# Altium schematic sheet POWER_5.SchDoc
size A3; SheetNumber: 7; SheetTotal: 13
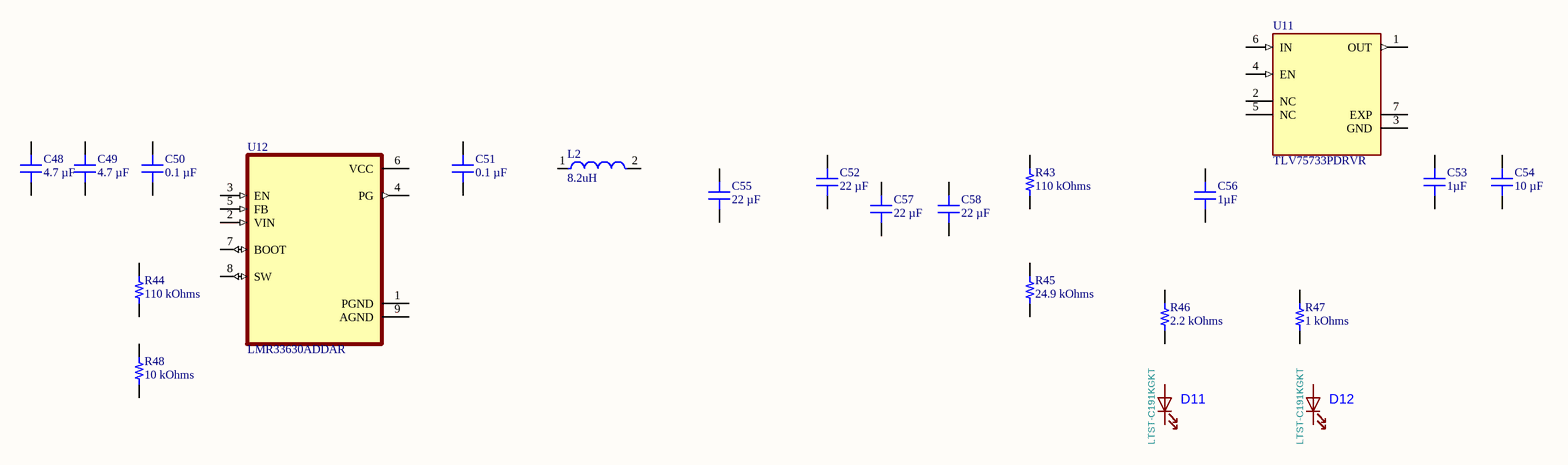
[diagram p0: POWER_5.SchDoc]

## Parts
C48  4.7 µF  [CAP 0603_1608]
C49  4.7 µF  [CAP 0603_1608]
C50  0.1 µF  [CAP 0603_1608]
C51  0.1 µF  [CAP 0603_1608]
C52  22 µF  [CAP 0603_1608]
C53  1µF  [CAP 0805_2012]
C54  10 µF  [CAP 0603_1608]
C55  22 µF  [CAP 0603_1608]
C56  1µF  [CAP 0805_2012]
C57  22 µF  [CAP 0603_1608]
C58  22 µF  [CAP 0603_1608]
D11  LTST-C191KGKT  [LED0603]
D12  LTST-C191KGKT  [LED0603]
L2  value 8.2uH  [Vishay_IHLP-2525CZ-FP_2_413x3_429-3D_3_0_MFG]  (hidden comment: FIXED IND 8.2UH 4A 68 MOHM SMD)
R43  110 kOhms  [RES 0603_1608]
R44  110 kOhms  [RES 0603_1608]
R45  24.9 kOhms  [RES 0603_1608]
R46  2.2 kOhms  [RES 0603_1608]
R47  1 kOhms  [RES 0603_1608]
R48  10 kOhms  [RES 0603_1608]
U11  TLV75733PDRVR  [VREG_TLV75733PDRVR]
U12  LMR33630ADDAR  [VREG_LM5017MR/NOPB]

## Nets

Not connected (* = marked no-connect by the designer): C48 1 2; C49 1 2; C50 1 2; C51 1 2; C52 1 2; C53 1 2; C54 1 2; C55 1 2; C56 1 2; C57 1 2; C58 1 2; D11 1(A) 2(K); D12 1(A) 2(K); L2 1 2; R43 1 2; R44 1 2; R45 1 2; R46 1 2; R47 1 2; R48 1 2; U11 1(OUT) 2(NC) 3(GND) 4(EN) 5(NC) 6(IN) 7(EXP); U12 1(PGND) 2(VIN) 3(EN) 4(PG) 5(FB) 6(VCC) 7(BOOT) 8(SW) 9(AGND)

## Library data of the parts
C48 C49 = CL10A475KL8NRNC: CAP CER 4.7UF 35V X5R 0603; manufacturer: Samsung Electro-Mechanics; Tolerance: ±10%; Part Number: CL10A475KL8NRNC; Capacitance: 4.7 µF; Applications: General Purpose; componentlink1description: Datasheet; componentlink1url: http://www.samsungsem.com/kr/support/product-search/mlcc/CL10A475KL8NRNC.jsp; componentlink2description: DigiKey Link; componentlink2url: https://www.digikey.com/en/products/detail/samsung-electro-mechanics/CL10A475KL8NRNC/5961278; Device Package: 0603 (1608 Metric); lastupdated: 6.04.2026 19:23:51; Lifecycle Status: Active; Minimum Order: 1; Mounting Type: Surface Mount, MLCC; Operating Temperature: -55°C ~ 85°C; Package / Case: 0603 (1608 Metric); packaging: TapeAndReel; partid: 2652; Part Status: Active; price: 0.08; series: CL; Size / Dimension: 0.063" L x 0.031" W (1.60mm x 0.80mm); Supplier 1: DigiKey; Supplier Part Number 1: 1276-6794-1-ND; Temperature Coefficient: X5R; Thickness (Max): 0.035" (0.90mm); value: 4.7 µF; Voltage - Rated: 35V
C50 C51 = HMK107BJ104KA-T: CAP CER 0.1UF 100V X5R 0603; manufacturer: Taiyo Yuden; Tolerance: ±10%; Part Number: HMK107BJ104KA-T; Capacitance: 0.1 µF; Applications: SMPS Filtering; componentlink1description: Datasheet; componentlink1url: https://ds.yuden.co.jp/TYCOMPAS/ut/detail?pn=HMK107BJ104KA-T  &u=M; componentlink2description: DigiKey Link; componentlink2url: https://www.digikey.com/en/products/detail/taiyo-yuden/HMK107BJ104KA-T/4970694; Device Package: 0603 (1608 Metric); Features: High Voltage; lastupdated: 6.04.2026 19:23:31; Lifecycle Status: Active; Minimum Order: 1; Mounting Type: Surface Mount, MLCC; Operating Temperature: -55°C ~ 85°C; Package / Case: 0603 (1608 Metric); packaging: TapeAndReel; partid: 8162; Part Status: Active; price: 0.01; series: M; Size / Dimension: 0.063" L x 0.031" W (1.60mm x 0.80mm); Supplier 1: DigiKey; Supplier Part Number 1: 587-5862-1-ND; Temperature Coefficient: X5R; Thickness (Max): 0.035" (0.90mm); value: 0.1 µF; Voltage - Rated: 100V
C52 C55 C57 C58 = CL10A226MP8NRNC: CAP CER 22UF 10V X5R 0603; manufacturer: Samsung Electro-Mechanics; Tolerance: ±20%; Part Number: CL10A226MP8NRNC; Capacitance: 22 µF; Applications: General Purpose; componentlink1description: Datasheet; componentlink1url: https://mm.digikey.com/Volume0/opasdata/d220001/medias/docus/339/CL10A226MP8NRNC_Spec.pdf; componentlink2description: DigiKey Link; componentlink2url: https://www.digikey.com/en/products/detail/samsung-electro-mechanics/CL10A226MP8NRNC/10478990; Device Package: 0603 (1608 Metric); lastupdated: 6.04.2026 19:18:15; Lifecycle Status: Active; Minimum Order: 1; Mounting Type: Surface Mount, MLCC; Operating Temperature: -55°C ~ 85°C; Package / Case: 0603 (1608 Metric); packaging: TapeAndReel; partid: 67717; price: 0.06; series: CL; Size / Dimension: 0.063" L x 0.031" W (1.60mm x 0.80mm); Supplier 1: DigiKey; Supplier Part Number 1: 1276-CL10A226MP8NRNCCT-ND; Temperature Coefficient: X5R; Thickness (Max): 0.039" (1.00mm); value: 22 µF; Voltage - Rated: 10V
C53 C56 = 08051C105K4T2A: CAP CER 1UF 100V X7R 0805; manufacturer: AVX Corporation; Tolerance: ±10%; Part Number: 08051C105K4T2A; Capacitance: 1µF; Applications: Automotive; componentlink1description: Datasheet; componentlink1url: http://datasheets.avx.com/AutoMLCC.pdf; componentlink2description: DigiKey Link; componentlink2url: http://digikey.com/product-detail/en/avx-corporation/08051C105K4T2A/478-12142-1-ND/9374711; Device Package: 0805 (2012 Metric); lastupdated: 2.09.2020 01:04:22; Lifecycle Status: Active; Minimum Order: 1; Mounting Type: Surface Mount, MLCC; Operating Temperature: -55°C ~ 125°C; Package / Case: 0805 (2012 Metric); packaging: TapeAndReel; partid: 13414; Part Status: Active; price: 0.09; Ratings: AEC-Q200; series: -; Size / Dimension: 0.079" L x 0.049" W (2.01mm x 1.25mm); Supplier 1: DigiKey; Supplier Part Number 1: 478-12142-1-ND; Temperature Coefficient: X7R; value: 1µF; Voltage - Rated: 100V
C54 = 0603YW106MAT2A: CAP CER 10UF 16V X6S 0603; manufacturer: KYOCERA AVX; Tolerance: ±20%; Part Number: 0603YW106MAT2A; Capacitance: 10 µF; Applications: General Purpose; componentlink2description: DigiKey Link; componentlink2url: https://www.digikey.com/en/products/detail/kyocera-avx/0603YW106MAT2A/16602928; Device Package: 0603 (1608 Metric); lastupdated: 6.04.2026 19:22:07; Lifecycle Status: Active; Minimum Order: 1; Mounting Type: Surface Mount, MLCC; Operating Temperature: -55°C ~ 105°C; Package / Case: 0603 (1608 Metric); packaging: CutTape; partid: 46681; Part Status: Active; price: 0.08; series: KGM - X6S; Size / Dimension: 0.063" L x 0.031" W (1.60mm x 0.80mm); Supplier 1: DigiKey; Supplier Part Number 1: 478-KGM15CS61C106MTCT-ND; Temperature Coefficient: X6S; Thickness (Max): 0.039" (1.00mm); value: 10 µF; Voltage - Rated: 16V
D11 D12 = LED: LED, Bright Green, 0603; Manufacturer: Lite-On Inc.; Footprint: LED_SMD:LED_0603_1608Metric; Manufacturer Part Number: LTST-C191KGKT; Supplier Part Number: 160-1446-1-ND; Value: LTST-C191KGKT
L2 = IHLP2525CZER8R2M01_1: 8.2 µH Shielded Molded Inductor 4 A 68mOhm Max Nonstandard; Order Code: Digi: 541-1012-2-ND; Manufacturer Part Number: IHLP2525CZER8R2M01; LCSC Manufacturer Part Number: IHLP2525CZER8R2M01; LCSC Part Number: C506576
R43 R44 = RMCF0603FT110K: RES 110K OHM 1% 1/10W 0603; Manufacturer: Stackpole Electronics Inc; Power (Watts): 0.1W, 1/10W; Temperature Coefficient: ±100ppm/°C; Part Number: RMCF0603FT110K; Value: 110 kOhms; ComponentLink1Description: Datasheet; ComponentLink1URL: https://www.seielect.com/catalog/sei-packaging.pdf; ComponentLink2Description: DigiKey Link; ComponentLink2URL: https://www.digikey.com/en/products/detail/stackpole-electronics-inc/RMCF0603FT110K/1761310; Composition: Thick Film; Device Package: 0603 (1608 Metric); Features: Automotive AEC-Q200; Height - Seated (Max): 0.022" (0.55mm); LastUpdated: 9.02.2024 20:43:13; Lifecycle Status: Active; Minimum Order: 1; Number of Terminations: 2; Operating Temperature: -55°C ~ 155°C; Package / Case: 0603 (1608 Metric); Packaging: CutTape; PartId: 10728; Part Status: Active; Price: 0.01; Ratings: AEC-Q200; Resistance: 110 kOhms; Series: RMCF; Size / Dimension: 0.061" L x 0.031" W (1.55mm x 0.80mm); Supplier 1: DigiKey; Supplier Part Number 1: RMCF0603FT110KCT-ND; Supplier Device Package: 0603; Tolerance: ±1%
R45 = RMCF0603FT24K9: RES 24.9K OHM 1% 1/10W 0603; Manufacturer: Stackpole Electronics Inc; Power (Watts): 0.1W, 1/10W; Temperature Coefficient: ±100ppm/°C; Part Number: RMCF0603FT24K9; Value: 24.9 kOhms; ComponentLink1Description: Datasheet; ComponentLink1URL: https://www.seielect.com/catalog/sei-rmcf_rmcp.pdf; ComponentLink2Description: DigiKey Link; ComponentLink2URL: https://www.digikey.com/en/products/detail/stackpole-electronics-inc/RMCF0603FT24K9/1760847; Composition: Thick Film; Device Package: 0603 (1608 Metric); Features: Automotive AEC-Q200; Height - Seated (Max): 0.022" (0.55mm); LastUpdated: 9.02.2024 20:43:13; Lifecycle Status: Active; Minimum Order: 1; Number of Terminations: 2; Operating Temperature: -55°C ~ 155°C; Package / Case: 0603 (1608 Metric); Packaging: CutTape; PartId: 10847; Part Status: Active; Price: 0.01; Ratings: AEC-Q200; Resistance: 24.9 kOhms; Series: RMCF; Size / Dimension: 0.061" L x 0.031" W (1.55mm x 0.80mm); Supplier 1: DigiKey; Supplier Part Number 1: RMCF0603FT24K9CT-ND; Supplier Device Package: 0603; Tolerance: ±1%
R46 = RMCF0603FT2K20: RES 2.2K OHM 1% 1/10W 0603; Manufacturer: Stackpole Electronics Inc; Power (Watts): 0.1W, 1/10W; Temperature Coefficient: ±100ppm/°C; Part Number: RMCF0603FT2K20; Value: 2.2 kOhms; ComponentLink1Description: Datasheet; ComponentLink1URL: https://www.seielect.com/catalog/sei-packaging.pdf; ComponentLink2Description: DigiKey Link; ComponentLink2URL: https://www.digikey.com/en/products/detail/stackpole-electronics-inc/RMCF0603FT2K20/1760987; Composition: Thick Film; Device Package: 0603 (1608 Metric); Features: Automotive AEC-Q200; Height - Seated (Max): 0.022" (0.55mm); LastUpdated: 9.02.2024 20:43:32; Lifecycle Status: Active; Minimum Order: 1; Number of Terminations: 2; Operating Temperature: -55°C ~ 155°C; Package / Case: 0603 (1608 Metric); Packaging: CutTape; PartId: 6089; Part Status: Active; Price: 0.01; Ratings: AEC-Q200; Resistance: 2.2 kOhms; Series: RMCF; Size / Dimension: 0.061" L x 0.031" W (1.55mm x 0.80mm); Supplier 1: DigiKey; Supplier Part Number 1: RMCF0603FT2K20CT-ND; Supplier Device Package: 0603; Tolerance: ±1%
R47 = RMCF0603FG1K00: RES 1K OHM 1% 1/10W 0603; Manufacturer: Stackpole Electronics Inc; Power (Watts): 0.1W, 1/10W; Temperature Coefficient: ±100ppm/°C; Part Number: RMCF0603FG1K00; Value: 1 kOhms; ComponentLink1Description: Datasheet; ComponentLink1URL: https://www.seielect.com/catalog/sei-packaging.pdf; ComponentLink2Description: DigiKey Link; ComponentLink2URL: https://www.digikey.com/en/products/detail/stackpole-electronics-inc/RMCF0603FG1K00/1713699; Composition: Thick Film; Device Package: 0603 (1608 Metric); Features: Automotive AEC-Q200; Height - Seated (Max): 0.022" (0.55mm); LastUpdated: 9.02.2024 20:42:15; Lifecycle Status: Active; Minimum Order: 1; Number of Terminations: 2; Operating Temperature: -55°C ~ 155°C; Package / Case: 0603 (1608 Metric); Packaging: CutTape; PartId: 24034; Part Status: Active; Price: 0.01; Ratings: AEC-Q200; Resistance: 1 kOhms; Series: RMCF; Size / Dimension: 0.061" L x 0.031" W (1.55mm x 0.80mm); Supplier 1: DigiKey; Supplier Part Number 1: RMCF0603FG1K00CT-ND; Supplier Device Package: 0603; Tolerance: ±1%
R48 = RMCF0603FT10K0: RES 10K OHM 1% 1/10W 0603; Manufacturer: Stackpole Electronics Inc; Power (Watts): 0.1W, 1/10W; Temperature Coefficient: ±100ppm/°C; Part Number: RMCF0603FT10K0; Value: 10 kOhms; ComponentLink1Description: Datasheet; ComponentLink1URL: https://www.seielect.com/catalog/sei-rmcf_rmcp.pdf; ComponentLink2Description: DigiKey Link; ComponentLink2URL: https://www.digikey.com/en/products/detail/stackpole-electronics-inc/RMCF0603FT10K0/1761235; Composition: Thick Film; Device Package: 0603 (1608 Metric); Features: Automotive AEC-Q200; Height - Seated (Max): 0.022" (0.55mm); LastUpdated: 9.02.2024 20:42:00; Lifecycle Status: Active; Minimum Order: 1; Number of Terminations: 2; Operating Temperature: -55°C ~ 155°C; Package / Case: 0603 (1608 Metric); Packaging: CutTape; PartId: 25663; Part Status: Active; Price: 0.01; Ratings: AEC-Q200; Resistance: 10 kOhms; Series: RMCF; Size / Dimension: 0.061" L x 0.031" W (1.55mm x 0.80mm); Supplier 1: DigiKey; Supplier Part Number 1: RMCF0603FT10K0CT-ND; Supplier Device Package: 0603; Tolerance: ±1%
U11 = TLV75733PDRVR: 1-A, low-IQ high-accuracy low-dropout (LDO) voltage regulator with enable; MF: Texas Instruments; SnapEDA_Link: https://www.snapeda.com/parts/TLV75733PDRVR/Texas+Instruments/view-part/?ref=snap; Package: WSON-6 Texas Instruments; Value: *; MP: TLV75733PDRVR; Check_prices: https://www.snapeda.com/parts/TLV75733PDRVR/Texas+Instruments/view-part/?ref=eda
U12 = LMR33630ADDAR: SIMPLE SWITCHERÂ® 3.8V to 36V, 3A Synchronous Buck Converter With Ultra-Low EMI; MF: Texas Instruments; SnapEDA_Link: https://www.snapeda.com/parts/LMR33630ADDAR/Texas+Instruments/view-part/?ref=snap; Package: HSOIC-8 Texas Instruments; Value: *; MP: LMR33630ADDAR; Check_prices: https://www.snapeda.com/parts/LMR33630ADDAR/Texas+Instruments/view-part/?ref=eda